# EAGLE design Teensy4.1V3 (EAGLE 9.6.2)

## Sheet 1 of 5
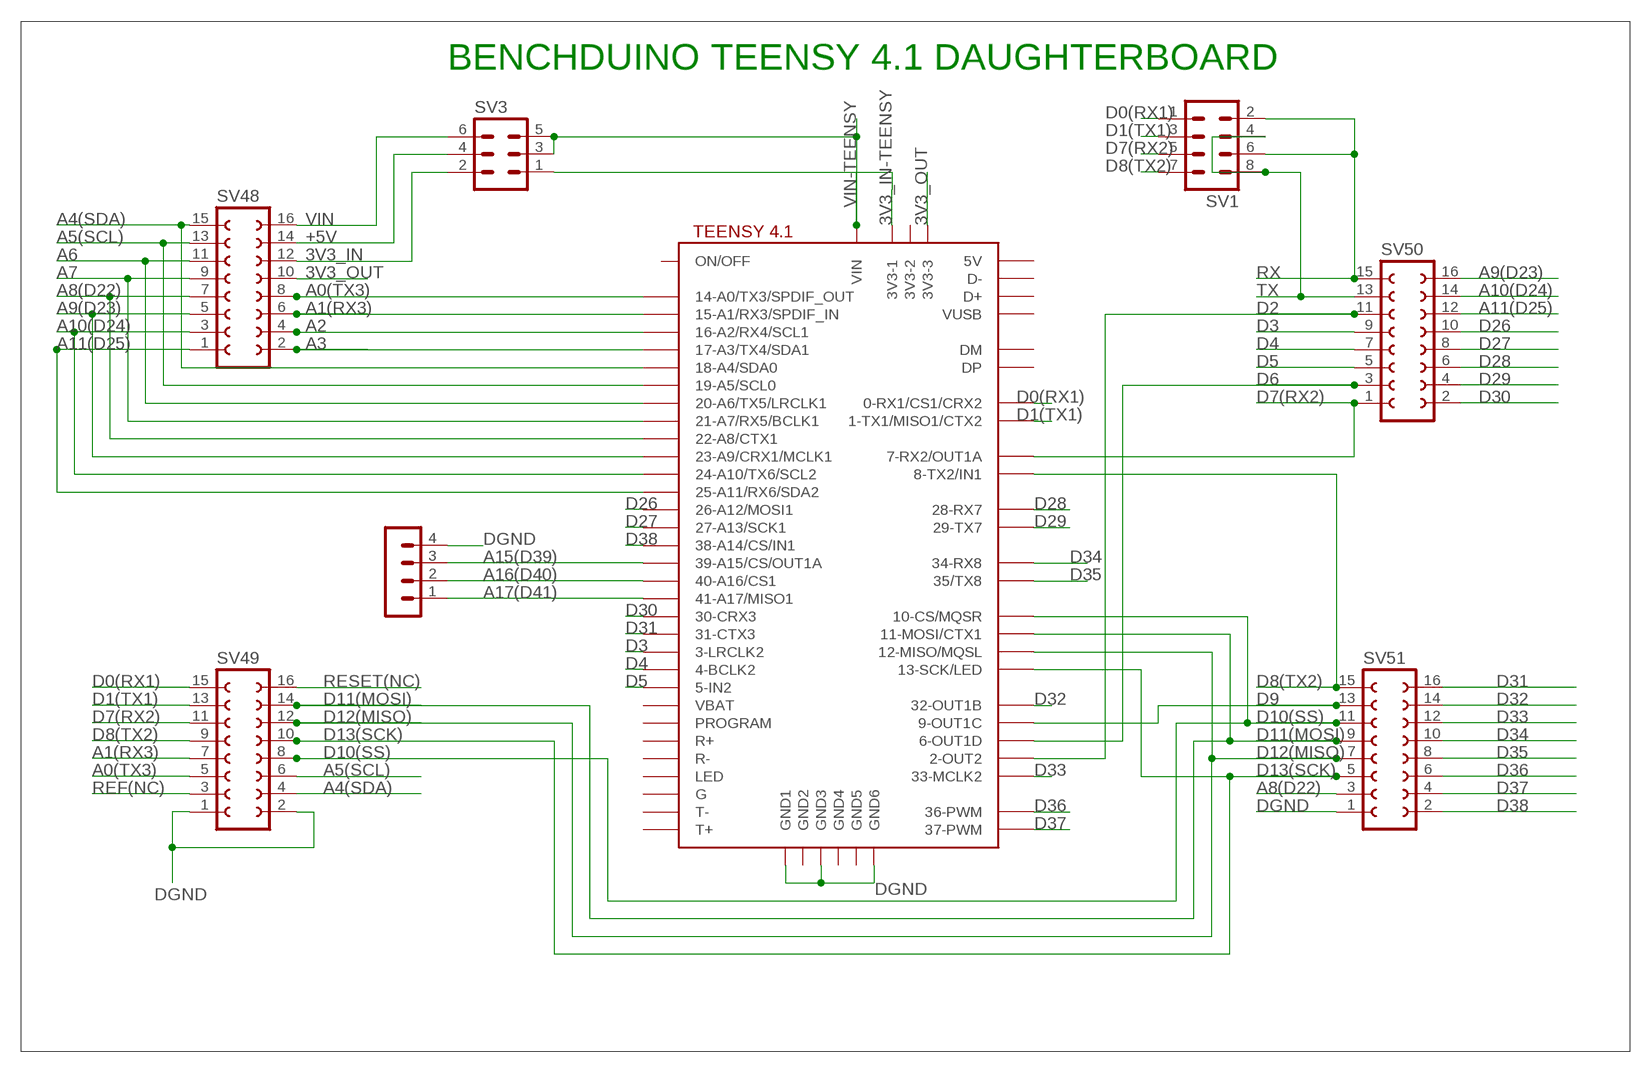
[diagram p0: schematic, sheet 1]

### Parts
SV1  MA04-2  [MA04-2]
SV3  MA03-2  [MA03-2]
SV4  MA04-1  [MA04-1]
SV48  FE08-2  [FE08-2]
SV49  FE08-2  [FE08-2]
SV50  FE08-2  [FE08-2]
SV51  FE08-2  [FE08-2]
U$1  TEENSY41  [TEENSY41]

### Nets
3V3_IN: SV3.2 SV48.12
3V3_IN-TEENSY: SV3.1 U$1.3V3-1
3V3_OUT: SV48.10 U$1.3V3-3
+5V: SV3.4 SV48.14
A0(TX3): SV48.8 SV49.5 U$1.14-A0/TX3/SPDIF_OUT
A1(RX3): SV48.6 SV49.7 U$1.15-A1/RX3/SPDIF_IN
A2: SV48.4 U$1.16-A2/RX4/SCL1
A3: SV48.2 U$1.17-A3/TX4/SDA1
A4(SDA): SV48.15 SV49.4 U$1.18-A4/SDA0
A5(SCL): SV48.13 SV49.6 U$1.19-A5/SCL0
A6: SV48.11 U$1.20-A6/TX5/LRCLK1
A7: SV48.9 U$1.21-A7/RX5/BCLK1
A8(D22): SV48.7 SV51.3 U$1.22-A8/CTX1
A9(D23): SV48.5 SV50.16 U$1.23-A9/CRX1/MCLK1
A10(D24): SV48.3 SV50.14 U$1.24-A10/TX6/SCL2
A11(D25): SV48.1 SV50.12 U$1.25-A11/RX6/SDA2
A15(D39): SV4.3 U$1.39-A15/CS/OUT1A
A16(D40): SV4.2 U$1.40-A16/CS1
A17(D41): SV4.1 U$1.41-A17/MISO1
D0(RX1): SV1.1 SV49.15 U$1.0-RX1/CS1/CRX2
D1(TX1): SV1.3 SV49.13 U$1.1-TX1/MISO1/CTX2
D2: SV50.11 U$1.2-OUT2
D3: SV50.9 U$1.3-LRCLK2
D4: SV50.7 U$1.4-BCLK2
D5: SV50.5 U$1.5-IN2
D6: SV50.3 U$1.6-OUT1D
D7(RX2): SV1.5 SV49.11 SV50.1 U$1.7-RX2/OUT1A
D8(TX2): SV1.7 SV49.9 SV51.15 U$1.8-TX2/IN2(8-TX2/IN1)
D9: SV51.13 U$1.9-OUT1C
D10(SS): SV49.8 SV51.11 U$1.10-CS\MQSR(10-CS/MQSR)
D11(MOSI): SV49.14 SV51.9 U$1.11-MOSI/CTX1
D12(MISO): SV49.12 SV51.7 U$1.12-MISO/MQSL
D13(SCK): SV49.10 SV51.5 U$1.13-SCK/LED
D26: SV50.10 U$1.26-A12/MOSI1
D27: SV50.8 U$1.27-A13/SCK1
D28: SV50.6 U$1.28-RX7
D29: SV50.4 U$1.29-TX7
D30: SV50.2 U$1.30-CRX3
D31: SV51.16 U$1.31-CTX3
D32: SV51.14 U$1.32-OUT1B
D33: SV51.12 U$1.33-MCLK2
D34: SV51.10 U$1.34-RX8
D35: SV51.8 U$1.35-TX8(35/TX8)
D36: SV51.6 U$1.36-PWM
D37: SV51.4 U$1.37-PWM
D38: SV51.2 U$1.38-A14/CS/IN1
DGND: SV4.4 SV49.1 SV49.2 SV51.1 U$1.GND1 U$1.GND3 U$1.GND6
REF(NC): SV49.3
RESET(NC): SV49.16
RX: SV1.2 SV1.6 SV50.15
TX: SV1.4 SV1.8 SV50.13
VIN: SV3.6 SV48.16
VIN-TEENSY: SV3.3 SV3.5 U$1.VIN
Unconnected: U$1.3V3-2 U$1.+5V(5V) U$1.D+ U$1.D- U$1.DM U$1.DP U$1.G U$1.GND2 U$1.GND4 U$1.GND5 U$1.LED U$1.ON/OFF U$1.PROGRAM U$1.R+ U$1.R- U$1.T+ U$1.T- U$1.VBAT U$1.VUSB

### Notes on the sheet
- BENCHDUINO TEENSY 4.1 DAUGHTERBOARD

## Sheet 2 of 5

## Sheet 3 of 5

## Sheet 4 of 5

## Sheet 5 of 5

## Library data of the parts
SV1 = con-lstb:MA04-2: PIN HEADER; OC_FARNELL: unknown; OC_NEWARK: unknown
SV3 = con-lstb:MA03-2: PIN HEADER; OC_FARNELL: unknown; OC_NEWARK: unknown
SV4 = con-lstb:MA04-1: PIN HEADER; OC_FARNELL: unknown; OC_NEWARK: unknown
SV48-SV51 = con-lsta:FE08-2: FEMALE HEADER; OC_FARNELL: unknown; OC_NEWARK: unknown
U$1 = teensy:TEENSY41

## Board
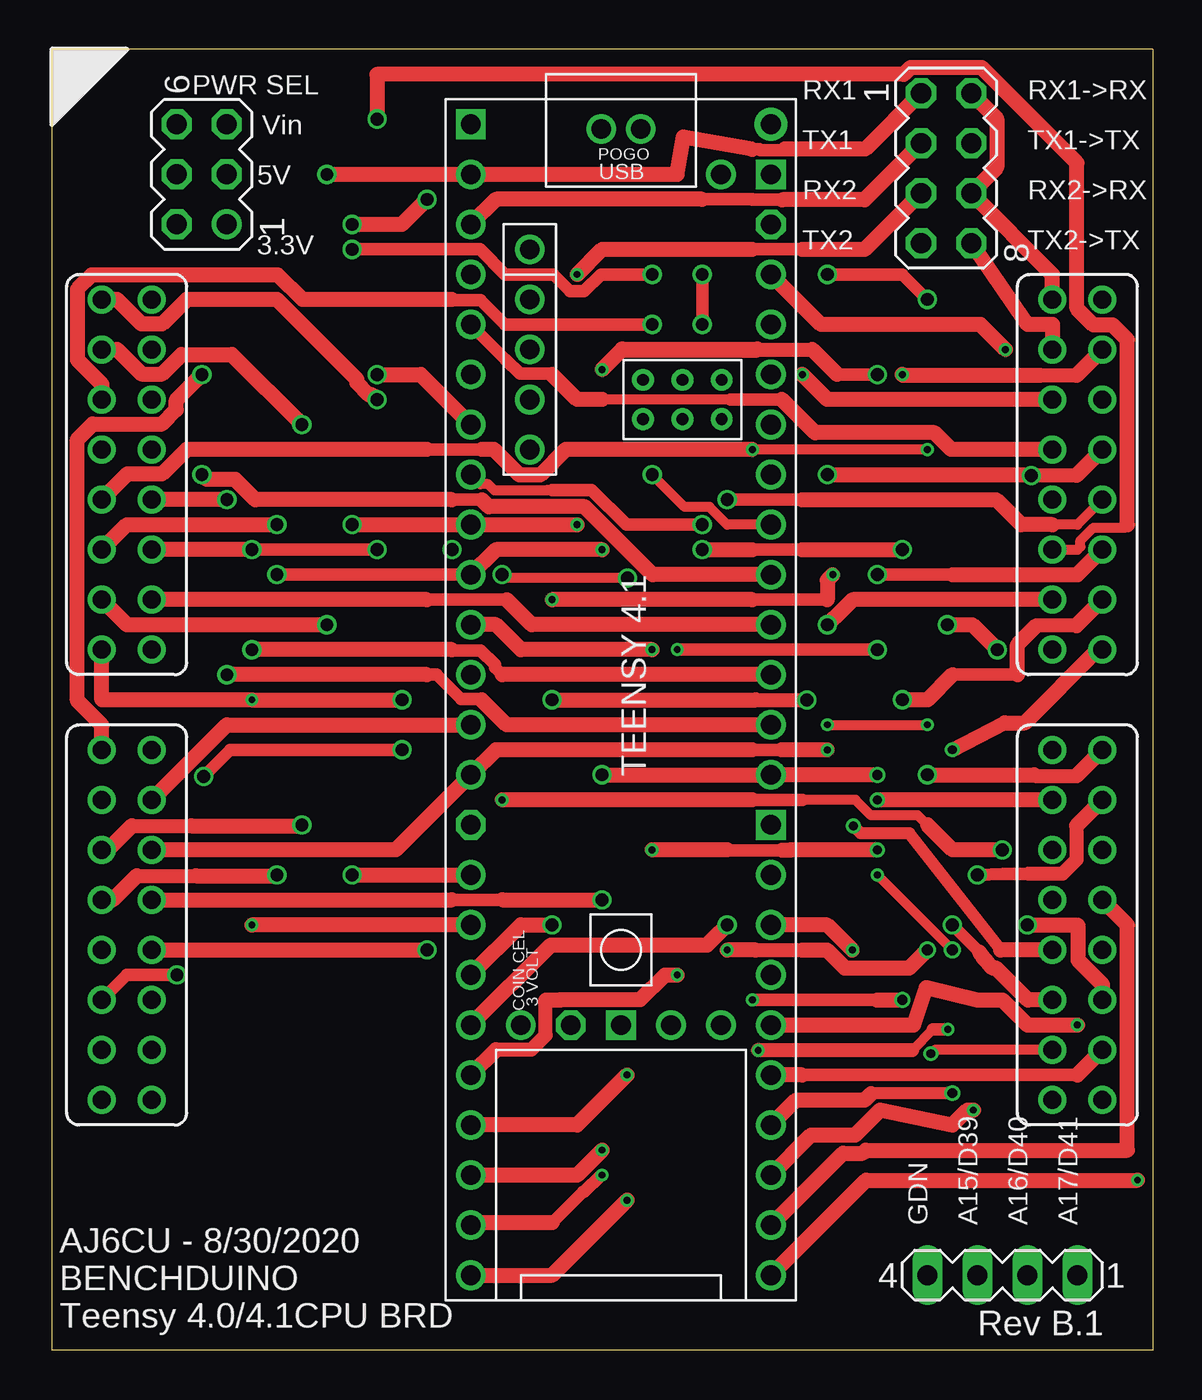
[diagram p1: board, top side]
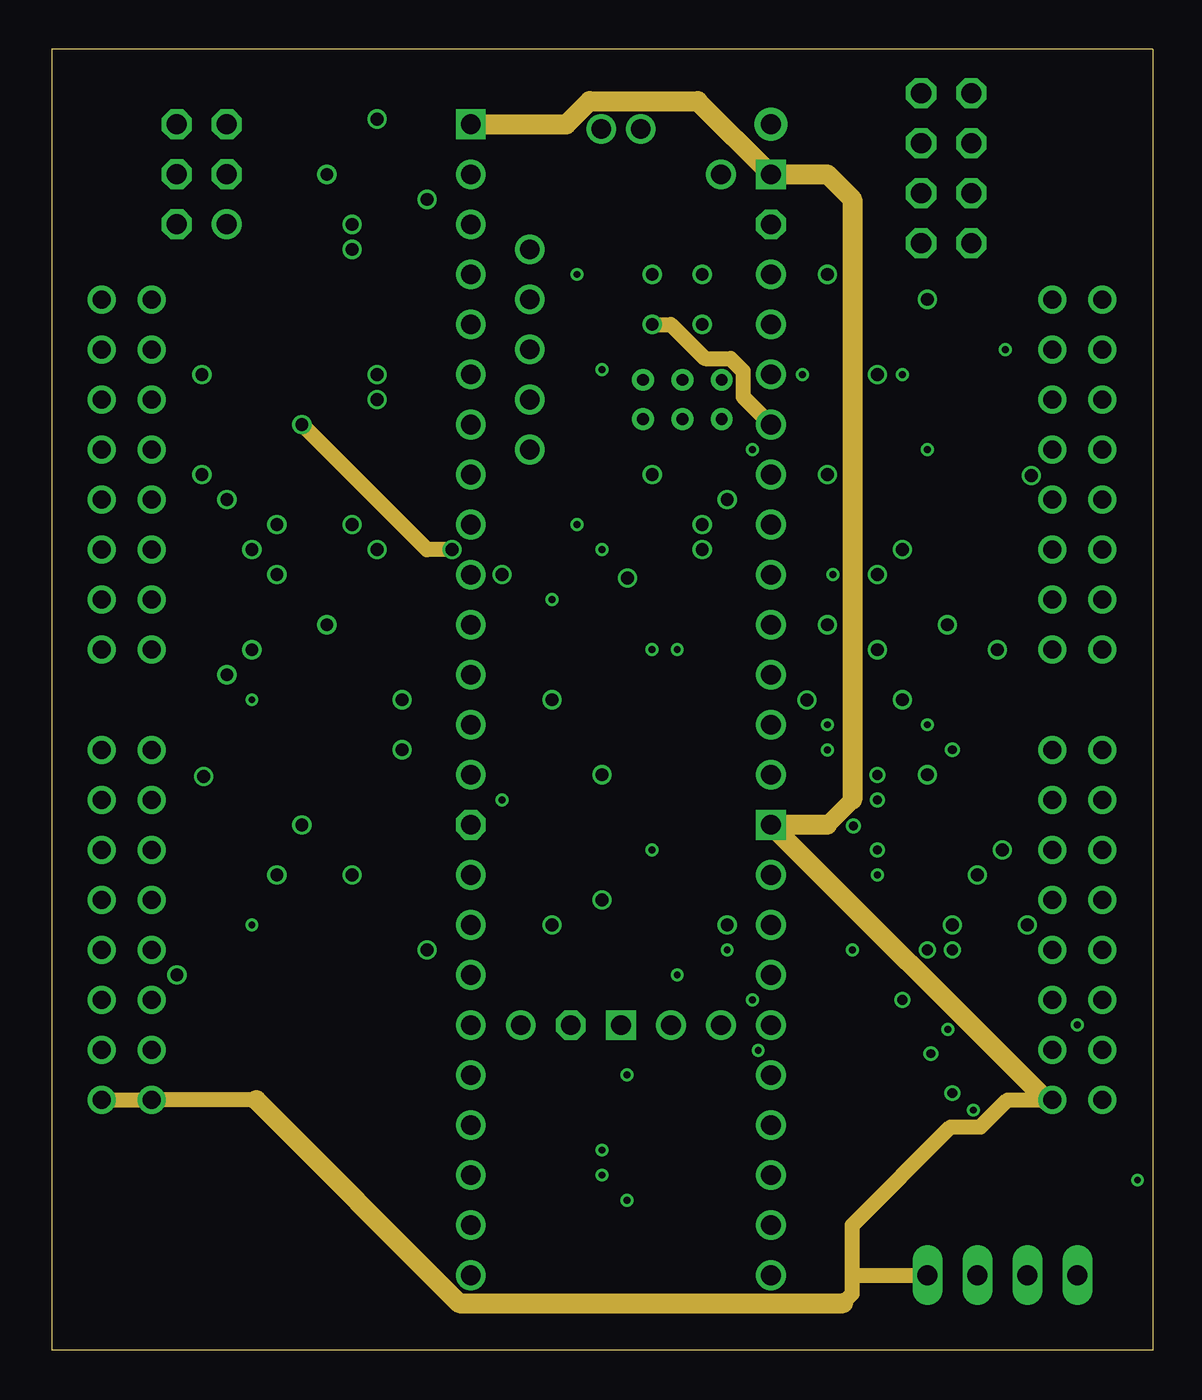
[diagram p2: board, inner layer Route2]
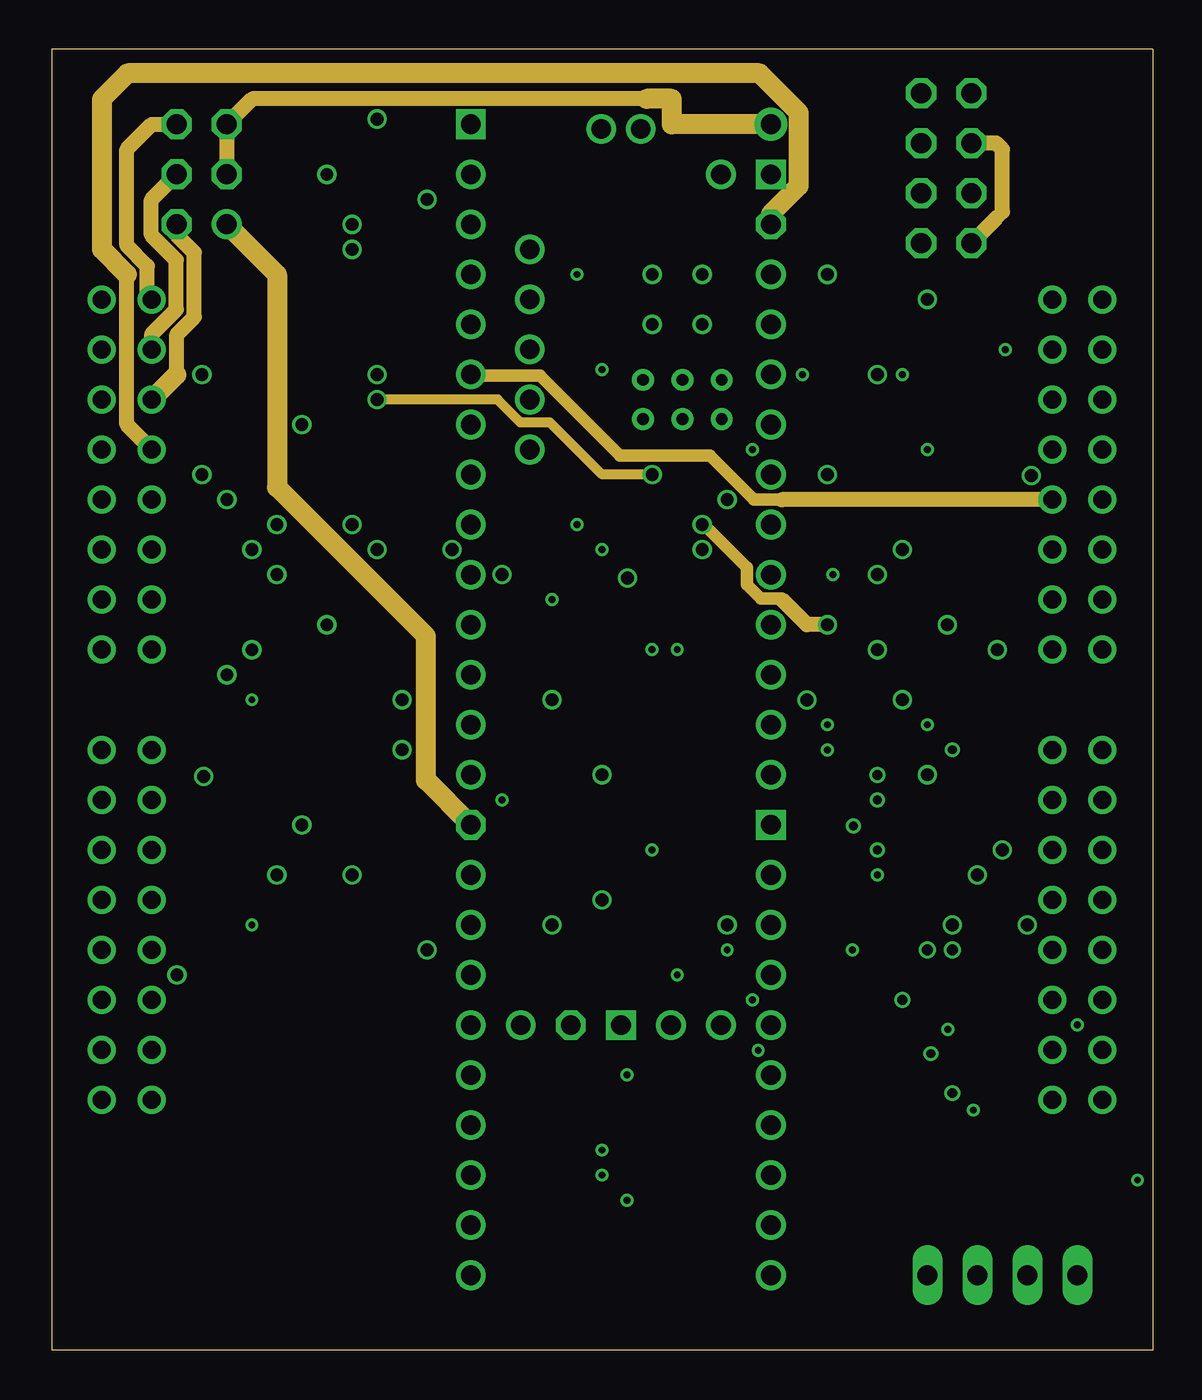
[diagram p3: board, inner layer Route15]
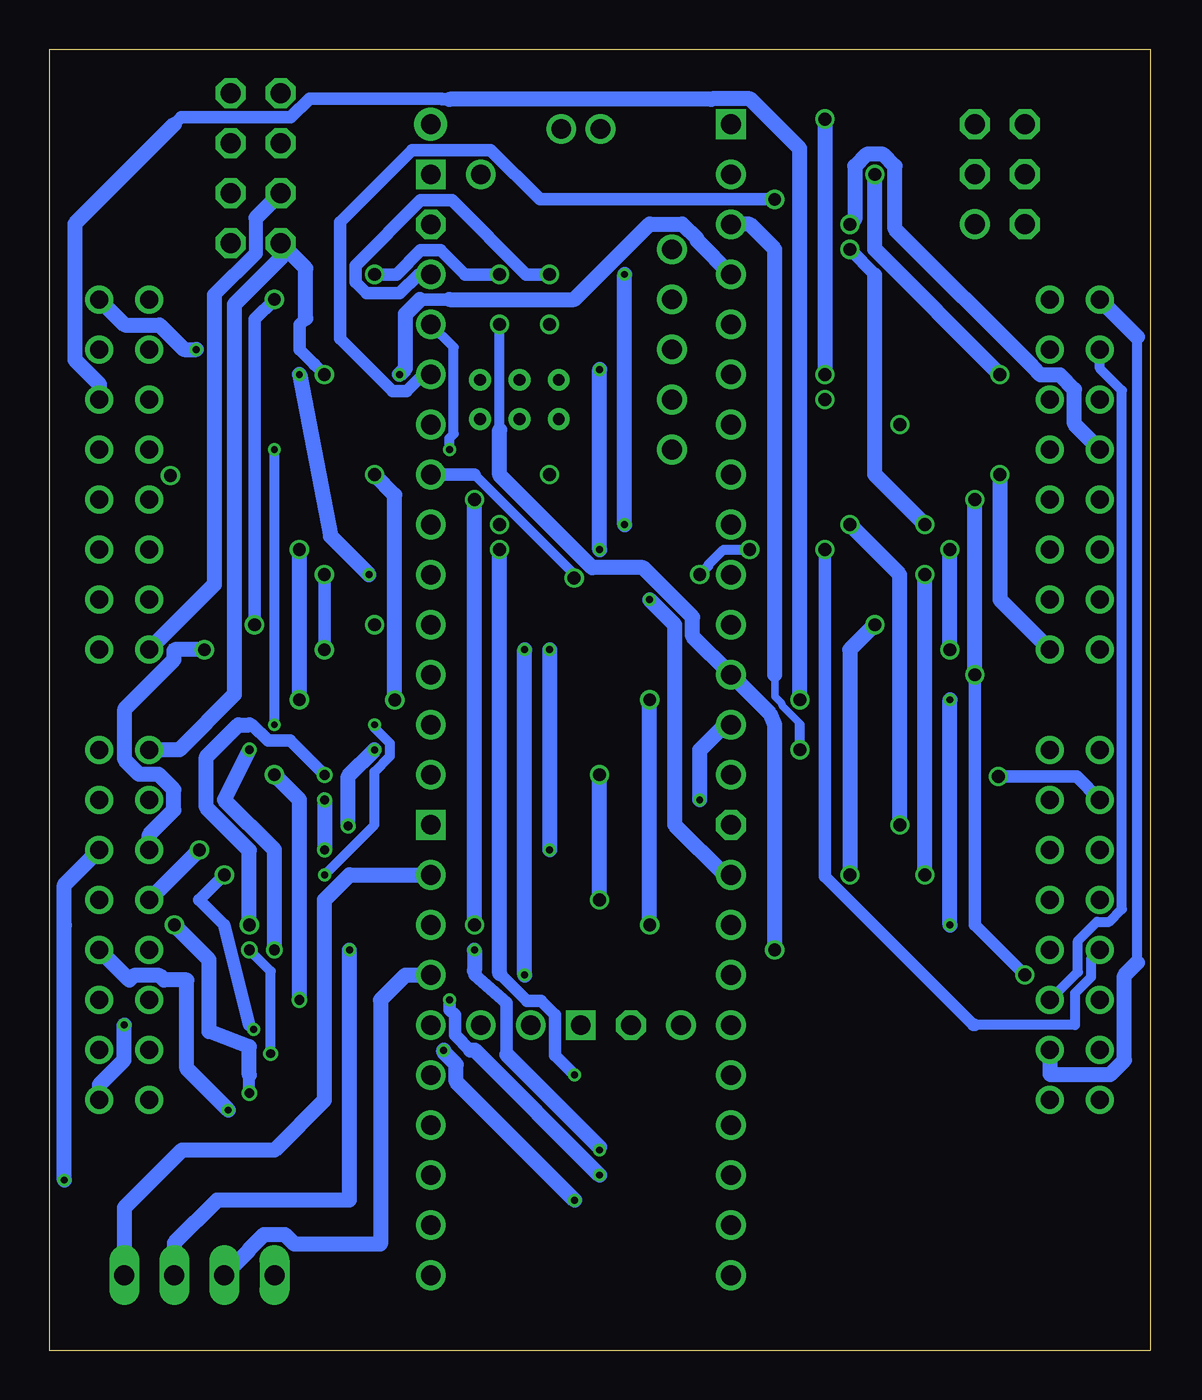
[diagram p4: board, bottom side, seen from below]

Size 55.88 x 66.04 mm. Coordinates in mm from the lower left corner, seen from the top.
Outline: 0,66.04 0,0 55.88,0 55.88,66.04 0,66.04
Copper layers (1*2*15*16): Top 0.035mm / dielectric 1.5mm / Route2 0.035mm / dielectric 0.15mm / Route15 0.035mm / dielectric 0.2mm / Bottom 0.035mm
Design rules "default *": minimum track width 6mil, minimum drill 12mil, track to track 6mil, track to pad 6mil, pad to pad 6mil, via to via 6mil, smd to smd 0mil, copper to edge 10mil, drill to drill 10mil, minimum pad ring 10mil, minimum via ring 6mil, stop-mask expansion 2mil, vias tented up to drill 100mil, thermal gap 10mil

### Footprints (pad centres in the part's own frame; a part is rotated, then mirrored left to right if it is on the bottom)
MA04-2 = drill 1.016 octagon: 1 -3.81,-1.27; 2 -3.81,1.27; 3 -1.27,-1.27; 4 -1.27,1.27; 5 1.27,-1.27; 6 1.27,1.27; 7 3.81,-1.27; 8 3.81,1.27
MA03-2 = drill 1.016: 1 -2.54,-1.27 | drill 1.016 octagon: 2 -2.54,1.27; 3 0,-1.27; 4 0,1.27; 5 2.54,-1.27; 6 2.54,1.27
MA04-1 = drill 1.016 long: 1 -3.81,0; 2 -1.27,0; 3 1.27,0; 4 3.81,0
FE08-2 = drill 0.914: 1 -8.89,1.27; 2 -8.89,-1.27; 3 -6.35,1.27; 4 -6.35,-1.27; 5 -3.81,1.27; 6 -3.81,-1.27; 7 -1.27,1.27; 8 -1.27,-1.27; 9 1.27,1.27; 10 1.27,-1.27; 11 3.81,1.27; 12 3.81,-1.27; 13 6.35,1.27; 14 6.35,-1.27; 15 8.89,1.27; 16 8.89,-1.27
TEENSY41 = drill 1: 0-RX1/CS1/CRX2 -27.94,-7.62; 1-TX1/MISO1/CTX2 -25.4,-7.62; 2-OUT2 -22.86,-7.62; 3-LRCLK2 -20.32,-7.62; 4-BCLK2 -17.78,-7.62; 5-IN2 -15.24,-7.62; 6-OUT1D -12.7,-7.62; 7-RX2/OUT1A -10.16,-7.62; 8-TX2/IN2 -7.62,-7.62; 9-OUT1C -5.08,-7.62; 10-CS\MQSR -2.54,-7.62; 11-MOSI/CTX1 0,-7.62; 12-MISO/MQSL 2.54,-7.62; 13-SCK/LED 2.54,7.62; 14-A0/TX3/SPDIF_OUT 0,7.62; 15-A1/RX3/SPDIF_IN -2.54,7.62; 16-A2/RX4/SCL1 -5.08,7.62; 17-A3/TX4/SDA1 -7.62,7.62; 18-A4/SDA0 -10.16,7.62; 19-A5/SCL0 -12.7,7.62; 20-A6/TX5/LRCLK1 -15.24,7.62; 21-A7/RX5/BCLK1 -17.78,7.62; 22-A8/CTX1 -20.32,7.62; 23-A9/CRX1/MCLK1 -22.86,7.62; 24-A10/TX6/SCL2 7.62,-7.62; 25-A11/RX6/SDA2 10.16,-7.62; 26-A12/MOSI1 12.7,-7.62; 27-A13/SCK1 15.24,-7.62; 28-RX7 17.78,-7.62; 29-TX7 20.32,-7.62; 30-CRX3 22.86,-7.62; 31-CTX3 25.4,-7.62; 32-OUT1B 27.94,-7.62; 33-MCLK2 27.94,7.62; 34-RX8 25.4,7.62; 35-TX8 22.86,7.62; 36-PWM 20.32,7.62; 37-PWM 17.78,7.62; 38-A14/CS/IN1 15.24,7.62; 39-A15/CS/OUT1A 12.7,7.62; 40-A16/CS1 10.16,7.62; 41-A17/MISO1 7.62,7.62; +5V -24.13,-4.62; D+ -30.25,-1; D- -30.25,1; DM -21.59,-4.62; DP -19.05,-4.62; GND4 -16.51,-4.62; GND5 -13.97,-4.62; ON/OFF 15.24,5.08; PROGRAM 15.24,2.54; VBAT 15.24,-5.08; VUSB -27.94,5.08 | drill 1 octagon: 3V3-1 5.08,-7.62; 3V3-2 15.24,-2.54; 3V3-3 -25.4,7.62 | drill 0.6: G -15.51,3.12; LED -17.51,3.12; R+ -17.51,5.12; R- -15.51,5.12; T+ -15.51,1.12; T- -17.51,1.12 | drill 1 square: GND1 -30.48,-7.62; GND2 15.24,0; GND3 5.08,7.62; GND6 -27.94,7.62 | drill 1 pad 1.676: VIN -30.48,7.62

### Placement (x,y rotation side)
SV1  45.4,60.01 270 top
SV3  7.62,59.69 90 top
SV4  48.26,3.81 180 top
SV48  3.81,44.45 90 top
SV49  3.81,21.59 90 top
SV50  52.07,44.45 90 top
SV51  52.07,21.59 90 top
U$1  28.89,31.75 270 top

### Tracks (layer width: path | path; a pad name or v marks a point on that pad's centre or on a via)
3V3_IN
  Route15 0.762: 6.33,49.51 6.35,49.53 6.35,51.56 7.24,52.45 7.24,55.72 6.35,56.61 SV3.2
  Route15 1.016: SV48.12 6.33,49.51
3V3_IN-TEENSY
  Route15 1.016: U$1.3V3-1 19,28.94 19,36.25 11.43,43.81 11.43,54.61 SV3.1
3V3_OUT
  Route15 0.762: 3.81,54.61 3.81,46.99 SV48.10
  Route15 1.016: U$1.3V3-3 36.51,57.69 37.93,59.1 37.93,62.82 35.93,64.81 3.85,64.81 2.54,63.5 2.54,55.88 3.81,54.61
+5V
  Route15 0.762: SV48.14 5.08,51.58 6.33,52.82 6.33,55.34 5.05,56.61 5.05,58.4 SV3.4
A0(TX3)  (via drill 0.65)
  Top 0.635: 21.82,33.02 21.78,33.07 20.77,33.07 19.54,34.29 19.05,34.29 | SV49.5 3.81,19.05 v6.35,19.05
  Top 0.762: U$1.14-A0/TX3/SPDIF_OUT 23.09,31.75 21.82,33.02 | 19.05,34.29 v8.89,34.29 | v8.89,43.18 SV48.8
  Bottom 0.635: v6.35,19.05 8.89,21.59 v8.89,34.29
  Bottom 0.762: v8.89,34.29 v8.89,43.18
A1(RX3)  (via drill 0.65)
  Top 0.635: 22.86,34.29 22.5,34.65 22.5,34.8 21.78,35.51 20.37,35.51 20.32,35.56 | v16.51,40.64 v10.16,40.64
  Top 0.762: U$1.15-A1/RX3/SPDIF_IN 22.86,34.29 | 20.32,35.56 v10.16,35.56 | v10.16,40.64 SV48.6
  Bottom 0.508: SV49.7 3,19.86 3,18.93 3.81,18.12 3.81,16.51 8.89,16.51
  Bottom 0.635: 8.89,16.51 8.97,16.51 16.51,24.05 v16.51,40.64
  Bottom 0.762: v10.16,35.56 v10.16,40.64
A2
  Top 0.635: 23.09,38.1 19.05,38.1
  Top 0.762: U$1.16-A2/RX4/SCL1 24.36,36.83 23.09,38.1 | 19.05,38.1 SV48.4
A3  (via drill 0.65)
  Top 0.635: 21.82,43.18 20.32,43.18
  Top 0.762: 21.82,43.18 22.18,42.82 27.05,42.82 30.5,39.37 U$1.17-A3/TX4/SDA1 | 20.32,43.18 10.33,43.18 9.31,44.2 7.87,44.2 v7.62,44.45
  Bottom 0.762: v7.62,44.45 7.62,38.1 SV48.2
A4(SDA)  (via drill 0.65)
  Top 0.508: U$1.18-A4/SDA0 34.28,41.91 33.39,42.8 32.13,42.8 v30.48,44.45
  Top 0.762: v16.51,48.26 16.26,48.51 16.09,48.51 15.49,49.11 15.49,49.28 11.43,53.34 6.84,53.34 5.6,52.09 4.56,52.09 3.32,53.34 SV48.15
  Route15 0.508: v30.48,44.45 27.94,44.45 25.29,47.1 23.79,47.1 22.63,48.26 v16.51,48.26
  Bottom 0.508: 0.64,19.68 0.64,51.44
  Bottom 0.762: SV49.4 5.08,14.02 5.05,13.99 2.02,13.99 1.29,14.72 1.29,19.02 0.64,19.68 | 0.64,51.44 SV48.15
A5(SCL)  (via drill 0.65)
  Top 0.508: v29.23,39.2 23.03,39.2 v22.86,39.37
  Top 0.762: SV48.13 3.32,50.8 4.56,49.55 5.6,49.55 6.59,50.55 9.14,50.55 v12.7,46.99
  Route2 0.762: v20.32,40.64 19.05,40.64 v12.7,46.99
  Bottom 0.508: SV49.6 3.66,19.2 3.66,20.78 2.7,21.74 2.08,21.74 1.42,22.4 1.42,48.72 2.54,49.84 SV48.13 | 34.29,44.45 29.23,39.39 v29.23,39.2 | v22.86,39.37 22.43,39.8 22.43,39.85 21.64,40.64 v20.32,40.64
  Bottom 0.635: U$1.19-A5/SCL0 34.29,44.45
A6  (via drill 0.65)
  Top 0.635: v30.48,52.07 23,52.07 21.78,53.29 20.37,53.29 20.32,53.34
  Top 0.762: 20.32,53.34 12.72,53.34 11.48,54.59 2.02,54.59 1.29,53.86 1.29,50.28 2.54,49.04 SV48.11
  Route2 0.762: v30.48,52.07 31.43,52.07 33.16,50.35 34.46,50.35 35.1,49.71 35.1,48.4 U$1.20-A6/TX5/LRCLK1
A7  (via drill 0.65)
  Top 0.762: v15.24,57.15 17.78,57.15 v19.05,58.42
  Bottom 0.635: U$1.21-A7/RX5/BCLK1 36.9,49.53 37.75,48.68 38.45,48.68 41.12,51.34 41.12,57.26 37.46,60.91 33.47,60.91 30.97,58.42 v19.05,58.42
  Bottom 0.762: SV48.9 3.83,47.02 3.83,48.78 4.56,49.51 5.54,49.51 5.96,49.92 12.95,56.91 12.95,60.11 13.55,60.71 14.39,60.71 14.99,60.11 14.99,57.4 v15.24,57.15
A8(D22)  (via drill 0.35, 0.45, 0.55)
  Top 0.508: SV51.3 44.82,15.24 v44.63,15.06 | v45.72,20.32 v41.91,24.13 | v39.37,31.75 v44.45,31.75 | v44.45,45.72 v35.56,45.72
  Top 0.635: 21.82,45.72 19.05,45.72
  Top 0.762: v35.56,45.72 26.09,45.72 24.81,44.43 23.74,44.43 22.45,45.72 21.82,45.72 | 19.05,45.72 6.84,45.72 5.6,44.48 3.83,44.48 SV48.7
  Bottom 0.508: v44.63,15.06 44.63,19.23 v45.72,20.32 | v41.91,24.13 39.37,26.67 39.37,29.37 38.58,30.15 38.58,30.81 39.37,31.59 v39.37,31.75 | v44.45,31.75 v44.45,45.72 | v35.56,45.72 35.56,46.3 35.35,46.51 35.35,50.91 U$1.22-A8/CTX1
A9(D23)  (via drill 0.35, 0.65)
  Top 0.635: v30.48,54.61 27.87,54.61 27.02,53.76 26.32,53.76 25.47,54.61 23,54.61 21.73,55.88 v15.24,55.88
  Top 0.762: v48.41,50.8 47.14,52.07 39.05,52.07 U$1.23-A9/CRX1/MCLK1 | SV48.5 3.81,41.91 v11.43,41.91
  Bottom 0.635: v30.48,54.61 31.67,54.61 35.43,58.37 37.02,58.37 40.33,55.07 40.33,54.21 39.77,53.65 38.09,53.65 37.13,54.61 U$1.23-A9/CRX1/MCLK1 | 13.97,54.59 13.97,54.61 v15.24,55.88
  Bottom 0.762: SV50.16 52.05,52.05 50.28,52.05 49.04,50.8 v48.41,50.8 | v11.43,41.91 13.97,44.45 13.97,54.59
A10(D24)  (via drill 0.35, 0.65)
  Top 0.635: 39.37,38.1 35.56,38.1
  Top 0.711: 52.02,49.48 50.17,49.48
  Top 0.762: SV50.14 52.02,49.48 | 50.17,49.48 43.23,49.48 v43.18,49.53 | v39.65,39.37 39.37,39.09 39.37,38.1 | 35.56,38.1 v25.4,38.1 | SV48.3 3.81,36.83 v13.97,36.83 | v15.24,24.13 U$1.24-A10/TX6/SCL2
  Bottom 0.762: v43.18,49.53 41.61,41.33 v39.65,39.37 | v25.4,38.1 24.13,36.83 24.13,26.67 21.59,24.13 U$1.24-A10/TX6/SCL2 | v13.97,36.83 15.24,35.56 v15.24,24.13
A11(D25)  (via drill 0.35, 0.65)
  Top 0.762: U$1.25-A11/RX6/SDA2 v10.16,21.59 | SV48.1 2.54,33.02 v10.16,33.02 v17.78,33.02
  Bottom 0.635: 35.56,63.5 35.93,63.5 35.97,63.54 42.67,63.54 43.62,62.59 49.17,62.59 49.53,62.23
  Bottom 0.762: v10.16,21.59 v10.16,33.02 | 35.56,63.5 22.27,63.5 22.25,63.52 20.3,63.52 17.78,61 v17.78,33.02 | SV50.12 53.34,49.04 54.59,50.28 54.59,57.17 49.53,62.23
A15(D39)
  Bottom 0.762: U$1.39-A15/CS/OUT1A 37.8,19.05 39.07,17.78 39.07,5.38 43.43,5.38 43.91,5.87 44.99,5.87 45.74,5.11 45.74,5.05 SV4.3
A16(D40)  (via drill 0.35)
  Top 0.762: v40.64,20.32 39.37,21.59 U$1.40-A16/CS1
  Bottom 0.762: v40.64,20.32 40.64,7.62 47.36,7.62 49.53,5.45 SV4.2
A17(D41)
  Bottom 0.762: U$1.41-A17/MISO1 40.64,24.13 41.91,22.86 41.91,12.7 44.45,10.16 49.15,10.16 52.07,7.24 SV4.1
D0(RX1)  (via drill 0.65)
  Top 0.635: 37.2,60.98 37.11,60.98 37.05,60.92 35.97,60.92 35.93,60.96 35.56,60.96
  Top 0.762: SV1.1 41.29,60.98 37.2,60.98 | 35.56,60.96 32.06,61.58 31.75,59.69 U$1.0-RX1/CS1/CRX2 v13.97,59.69 | v7.62,49.53 6.33,48.23 6.33,47.74 5.6,47.02 2.08,47.02 1.29,46.24 1.29,32.97 2.54,31.73 SV49.15
  Bottom 0.762: v7.62,49.53 13.97,55.88 v13.97,59.69
D1(TX1)  (via drill 0.65)
  Top 0.635: 37.08,58.4 35.58,58.4 35.56,58.42 33.02,58.42 | v7.71,29.12 9.06,30.48 v17.78,30.48
  Top 0.762: SV1.3 41.26,58.4 37.08,58.4 | 33.02,58.42 22.54,58.42 U$1.1-TX1/MISO1/CTX2
  Bottom 0.381: 17.78,31.75 17.78,31.82 18.66,32.7 18.72,32.85 19.05,33.18 19.05,34.29
  Bottom 0.508: v17.78,30.48 17.78,31.75
  Bottom 0.635: SV49.13 3.72,29.12 v7.71,29.12
  Bottom 0.762: U$1.1-TX1/MISO1/CTX2 20.32,57.15 19.05,55.88 19.05,34.29
D2  (via drill 0.35)
  Top 0.762: SV50.11 39.37,48.26 v38.1,49.53
  Bottom 0.635: 37.06,53.34 35.56,53.34
  Bottom 0.762: v38.1,49.53 37.8,49.83 37.8,52.6 37.06,53.34 | 35.56,53.34 29.23,53.34 25.41,57.17 23.74,57.17 22.98,56.41 22.98,56.32 U$1.2-OUT2
D3
  Top 0.508: 34.46,48.26 27.94,48.26
  Top 0.635: 37.06,48.26 34.46,48.26 | 25.4,49.53 25.35,49.58 23.77,49.58 23.05,50.29 U$1.3-LRCLK2
  Top 0.762: SV50.9 45.67,45.72 44.81,46.58 38.74,46.58 37.06,48.26 | 27.94,48.26 26.67,48.26 25.4,49.53
D4
  Route15 0.635: 37.06,43.18 35.64,43.18 33.42,45.41 28.86,45.41 24.78,49.48 21.32,49.48 U$1.4-BCLK2
  Route15 0.762: SV50.7 37.06,43.18
D5  (via drill 0.65)
  Top 0.508: SV50.5 52.07,40.64 52.22,40.79 52.22,41.1 52.88,41.76 54.46,41.76 54.61,41.91
  Top 0.762: 54.61,41.91 54.61,51.29 53.86,52.05 52.88,52.05 52.05,52.88 52.05,60.28 47.21,65.11 43.6,65.11 43.25,64.77 16.51,64.77 v16.51,62.5 | v16.51,49.53 18.73,49.53 U$1.5-IN2
  Bottom 0.762: v16.51,62.5 v16.51,49.53
D6  (via drill 0.65)
  Top 0.508: 25.4,43.67 25.16,43.67 25.13,43.65 22.47,43.65 22.15,43.97 21.75,43.97 U$1.6-OUT1D
  Top 0.635: v33.02,41.91 29.17,41.91 27.4,43.67 25.4,43.67
  Top 0.762: v39.37,36.83 39.73,37.19 39.75,37.19 40.66,38.1 SV50.3
  Route15 0.635: 37.06,38.1 37.02,38.15 36.01,38.15 35.29,38.86 35.29,39.73 33.1,41.91 v33.02,41.91
  Route15 0.762: v39.37,36.83 38.33,36.83 37.06,38.1
D7(RX2)  (via drill 0.35, 0.65)
  Top 0.635: 35.56,55.88 38.1,55.88
  Top 0.711: 4.07,26.62 7.08,26.62
  Top 0.762: v26.67,41.91 U$1.7-RX2/OUT1A v15.24,41.91 | SV49.11 2.85,25.4 4.07,26.62 | v26.67,54.61 27.94,55.88 35.56,55.88 | 38.1,55.88 41.27,55.88 SV1.5 | 7.08,26.62 12.65,26.62 v12.7,26.67
  Bottom 0.711: 45.4,57.47 45.4,55.67 47.5,53.58
  Bottom 0.762: SV1.5 45.4,57.47 | SV50.1 47.5,38.86 47.5,53.58 | v26.67,41.91 v26.67,54.61 | v12.7,26.67 12.7,39.37 v15.24,41.91
D8(TX2)  (via drill 0.35, 0.65)
  Top 0.635: 39.88,49.53 v41.91,49.53 | v11.43,39.37 U$1.8-TX2/IN2
  Top 0.711: 4.32,24.08 7.32,24.08 | 35.81,50.8 38.61,50.8
  Top 0.762: v27.94,49.78 28.96,50.8 | SV49.9 3.1,22.86 4.32,24.08 | 38.61,50.8 39.88,49.53 | v27.94,40.64 22.54,40.64 U$1.8-TX2/IN2 | 7.32,24.08 11.38,24.08 v11.43,24.13
  Top 0.813: 28.96,50.8 35.81,50.8
  Bottom 0.635: v41.91,49.53 42.41,50.03 42.41,50.04 42.43,50.05 43.18,50.8 43.18,52.07 42.86,52.39
  Bottom 0.762: SV51.15 49.28,30.48 46.48,33.27 46.48,53.09 44.13,55.44 SV1.7 42.86,54.93 42.86,52.39 | v27.94,40.64 v27.94,49.78 | v11.43,24.13 v11.43,39.37
D9  (via drill 0.35, 0.45)
  Top 0.635: 37.08,25.38 34.31,25.38 34.29,25.4
  Top 0.762: SV51.13 v41.91,27.94 | v41.91,25.4 37.51,25.4 37.49,25.38 37.08,25.38 | 34.29,25.4 v30.48,25.4 | v30.48,35.56 23.81,35.56 22.54,36.83 U$1.9-OUT1C
  Bottom 0.762: v41.91,27.94 v41.91,25.4 | v30.48,35.56 v30.48,25.4
D10(SS)  (via drill 0.65)
  Top 0.635: v33.02,52.07 v33.02,54.61 | v39.37,54.61 43.18,54.61 v44.45,53.34
  Top 0.762: SV49.8 v19.05,20.32 | v45.46,36.83 46.73,36.83 v48,35.56
  Bottom 0.508: 33.01,46.72 v33.01,52.06
  Bottom 0.635: v33.01,52.06 v33.02,52.07 | v33.02,54.61 34.78,54.61 36.01,55.83 37.02,55.83 38.24,54.61 v39.37,54.61 | v44.45,53.34 45.46,52.33 v45.46,36.83
  Bottom 0.762: SV51.11 50.8,26.18 49.55,27.42 49.55,28.46 50.34,29.23 51.32,29.23 52.05,29.96 52.05,32.55 49.55,35.04 49.55,35.51 49.51,35.56 v48,35.56 | v19.05,20.32 19.05,31.75 19.27,32.29 U$1.10-CS\MQSR 23.22,36.23 23.22,37.21 25.73,39.73 28.32,39.73 33.01,44.42 33.01,46.72
D11(MOSI)  (via drill 0.35, 0.65)
  Top 0.508: 44.45,26.67 43.97,27.15 41.58,27.15 40.8,27.94 38.1,27.94
  Top 0.635: 38.1,27.94 35.56,27.94
  Top 0.762: v48.26,25.4 45.72,25.4 44.45,26.67 | 35.56,27.94 v22.86,27.94 | SV49.14 8.89,31.75 U$1.11-MOSI/CTX1
  Bottom 0.762: SV51.9 v48.26,25.4 | v22.86,27.94 22.86,30.48 21.59,31.75 U$1.11-MOSI/CTX1
D12(MISO)  (via drill 0.35, 0.45)
  Top 0.61: 43.53,26.24 41.07,26.24 v40.7,26.61
  Top 0.635: 48.17,20.32 43.53,26.24 | 37.06,30.48 35.56,30.48
  Top 0.762: SV51.7 48.17,20.32 | v39.37,30.48 37.06,30.48 | 35.56,30.48 22.54,30.48 U$1.12-MISO/MQSL 17.46,25.4 SV49.12
  Bottom 0.762: v40.7,26.61 40.7,29.15 v39.37,30.48
D13(SCK)  (via drill 0.5, 0.65)
  Top 0.635: 47.26,19.94 47.26,20 | 47.1,20.21 v45.72,21.59 | 20.32,22.86 22.86,22.86
  Top 0.762: SV51.5 49.55,17.78 47.93,19.41 47.8,19.41 47.75,19.45 47.69,19.46 47.49,19.71 47.26,19.94 | 47.26,20 47.1,20.21 | v41.91,29.21 36.83,29.21 U$1.13-SCK/LED v27.94,29.21 | SV49.10 20.32,22.86 | 22.86,22.86 v27.94,22.86
  Bottom 0.635: 45.72,31.75 45.58,31.75 44.78,30.95 43.65,30.95 v41.91,29.21
  Bottom 0.762: v45.72,21.59 45.72,25.38 47.9,27.56 47.9,30.12 46.28,31.75 45.72,31.75 | v27.94,22.86 v27.94,29.21
D26  (via drill 0.65)
  Top 0.711: 35.74,33.01 v38.34,33.01 | 52.02,44.4 v49.73,44.4
  Top 0.762: SV50.10 52.02,44.4 | U$1.26-A12/MOSI1 23.82,21.59 v25.4,21.59 | v25.4,33.02 35.73,33.02 35.74,33.01 | v39.37,44.45 49.67,44.45 v49.73,44.4
  Bottom 0.762: v25.4,21.59 v25.4,33.02 | v38.34,33.01 38.34,43.42 v39.37,44.45
D27  (via drill 0.65)
  Top 0.508: SV50.8 52.07,41.91 50.8,41.91
  Top 0.635: v34.29,43.18 38.1,43.18
  Top 0.762: U$1.27-A13/SCK1 25.34,20.57 33.27,20.57 33.92,21.23 33.93,21.23 v34.29,21.59 | 50.8,41.91 49.22,41.91 47.95,43.18 38.1,43.18
  Bottom 0.762: v34.29,21.59 v34.29,43.18
D28  (via drill 0.35, 0.65)
  Top 0.635: v41.91,39.37 45.72,39.37 | v31.75,35.56 v41.91,35.56
  Top 0.711: 22.55,15.25 24.34,15.25 25.07,15.99 25.07,17.59
  Top 0.762: 22.55,15.25 U$1.28-RX7 | SV50.6 52.07,39.37 45.72,39.37 | 25.07,17.59 25.07,17.78 25.8,17.78 25.82,17.8 29.87,17.8 31.12,19.05 v31.75,19.05
  Bottom 0.635: v41.91,35.56 v41.91,39.37
  Bottom 0.762: v31.75,19.05 v31.75,35.56
D29  (via drill 0.35, 0.65)
  Top 0.635: 49.02,34.29 45.72,34.29 | 35.56,40.64 38.1,40.64
  Top 0.711: 52.02,36.78 49.99,36.78
  Top 0.762: 49.99,36.78 49.02,35.81 49.02,34.29 | U$1.29-TX7 26.67,11.43 v29.21,13.97 | SV50.4 52.02,36.78 | v33.02,40.64 35.56,40.64 | 38.1,40.64 v43.18,40.64 | 45.72,34.29 44.45,33.02 v43.18,33.02
  Bottom 0.635: 33.02,19.12 31.64,17.73 30.93,17.73 30.21,17.02 30.21,14.97 v29.21,13.97
  Bottom 0.762: 33.02,19.12 v33.02,40.64 | v43.18,33.02 v43.18,40.64
D30  (via drill 0.35, 0.45, 0.55)
  Top 0.635: v34.3,20.31 v34.29,20.32
  Top 0.711: 35.74,20.31 38.09,20.31
  Top 0.762: U$1.30-CRX3 26.67,8.89 v27.94,10.16 | 35.74,20.31 v34.3,20.31 | 38.09,20.31 39.35,20.31 40.26,19.41 43.54,19.41 v44.45,20.32 | v45.72,30.48 48.36,31.85 49.4,31.85 53.11,35.56 SV50.2
  Bottom 0.635: 34.29,19.27 34.29,19.05 32.66,17.64 32.66,15.02 | 27.94,10.3 v27.94,10.16
  Bottom 0.762: v34.29,20.32 34.29,19.27 | 32.66,15.02 27.94,10.3 | v44.45,20.32 44.45,25.4 46.99,27.94 v45.72,30.48
D31  (via drill 0.35, 0.5, 0.65)
  Top 0.635: 25.4,6.48 26.96,8.04 27.02,8.04 27.87,8.89 v27.94,8.89 | 49.86,29.21 49.91,29.16 | v35.56,17.78 41.91,17.78
  Top 0.711: 49.91,29.16 52.02,29.16
  Top 0.762: SV51.16 52.02,29.16 | U$1.31-CTX3 21.53,6.35 21.65,6.48 25.4,6.48 | v44.45,29.21 49.86,29.21 | 41.91,17.78 v43.18,17.78
  Bottom 0.635: v35.56,17.78 35.56,17.29 35.29,17.02 35.29,16 34.51,15.22
  Bottom 0.762: v43.18,17.78 43.18,27.94 v44.45,29.21 | v27.94,8.89 34.27,15.22 34.51,15.22
D32  (via drill 0.35, 0.65)
  Top 0.508: 44.74,16.29 43.68,15.23
  Top 0.635: 49.58,24.18 48.31,24.18 v46.99,24.13 | v45.5,16.29 44.74,16.29
  Top 0.711: 52.02,26.62 52.02,24.89 51.3,24.18 49.58,24.18 | 43.68,15.23 v35.86,15.23
  Top 0.762: SV51.14 52.02,26.62 | v29.21,7.62 25.4,3.81 U$1.32-OUT1B
  Bottom 0.635: v46.99,24.13 48.26,22.86 46.99,21.59 45.72,16.51 v45.5,16.29
  Bottom 0.762: v29.21,7.62 35.23,13.63 35.23,14.5 35.86,15.14 v35.86,15.23
D33  (via drill 0.35)
  Top 0.762: U$1.33-MCLK2 41.34,8.64 v55.12,8.64
  Bottom 0.762: v55.12,8.64 55.12,21.59 55.12,23.62 SV51.12
D34
  Top 0.762: U$1.34-RX8 40.17,10.01 41.17,10.01 41.32,10.16 54.61,10.16 54.61,21.59 SV51.10
D35  (via drill 0.35)
  Top 0.762: U$1.35-TX8 38.54,10.92 40.79,10.92 42.06,12.19 45.72,11.43 46.48,12.19 v46.79,12.19
  Bottom 0.762: v46.79,12.19 48.9,14.3 48.9,18.8 50.06,18.8 50.28,19.02 51.58,19.02 51.81,18.79 SV51.8
D36  (via drill 0.5, 0.65)
  Top 0.61: 41.59,13.02 41.63,13.05 v45.72,13.05
  Top 0.762: U$1.36-PWM 37.78,12.7 41.27,12.7 41.59,13.02 | v49.53,21.59 52.07,21.59 52.09,21.57 52.09,19.8 53.34,18.56 SV51.6
  Bottom 0.61: v45.72,13.05 45.72,13.97
  Bottom 0.762: v49.53,21.59 47.77,19.82 47.77,16.18 45.72,15.4 45.72,13.97
D37
  Top 0.635: 52.07,13.97 38.1,13.97
  Top 0.762: SV51.4 52.07,13.97 | 38.1,13.97 36.83,13.97 U$1.37-PWM
D38  (via drill 0.35)
  Top 0.762: U$1.38-A14/CS/IN1 43.76,16.51 44.39,18.42 46.99,17.78 48.26,17.78 49.53,16.51 v52.07,16.51
  Bottom 0.762: v52.07,16.51 52.09,16.48 52.09,14.72 53.34,13.48 SV51.2
DGND
  Route2 0.762: SV49.1 SV49.2 10.38,12.7 | 40.18,2.4 40.64,2.86 40.64,3.81 | 40.64,3.81 40.64,6.35 45.62,11.33 47.15,11.33 48.51,12.7 SV51.1 | 40.64,3.81 SV4.4
  Route2 0.889: 40.64,27.94 39.37,26.67
  Route2 1.016: U$1.GND1 26.12,62.23 27.31,63.41 32.79,63.41 U$1.GND6 39.37,59.69 40.64,58.42 40.64,27.94 | 39.37,26.67 U$1.GND3 50.48,12.7 SV51.1 | 40.18,2.4 20.69,2.4 10.38,12.7
RX
  Top 0.762: SV50.15 50.8,54.61 SV1.6 47.97,60.03 47.97,62.52 SV1.2
TX
  Top 0.762: SV1.8 49.53,52.07 50.8,52.07 SV50.13
  Route15 0.711: 47.97,57.49 48.26,57.78
  Route15 0.762: SV1.8 47.97,57.49 | 48.26,57.78 48.26,60.96 47.94,61.28 SV1.4
VIN
  Route15 0.762: SV48.16 4.85,53.57 4.85,55.04 3.81,56.08 3.81,60.96 5.08,62.23 SV3.6
VIN-TEENSY
  Route15 0.762: 30.2,63.52 10.18,63.52 SV3.5 SV3.3
  Route15 1.016: U$1.VIN 31.48,62.23 31.48,63.5 31.47,63.52 30.2,63.52

### Text on the board
tPlace: PWR SEL | RX1 | RX1->RX | Vin | TX1 | TX1->TX | 5V | RX2 | RX2->RX | 3.3V | TX2 | TX2->TX | GDN | A15/D39 | A16/D40 | A17/D41 | AJ6CU - 8/30/2020 / BENCHDUINO / Teensy 4.0/4.1CPU BRD | Rev B.1